# EAGLE design ahrs_v2 (EAGLE 9.6.2)
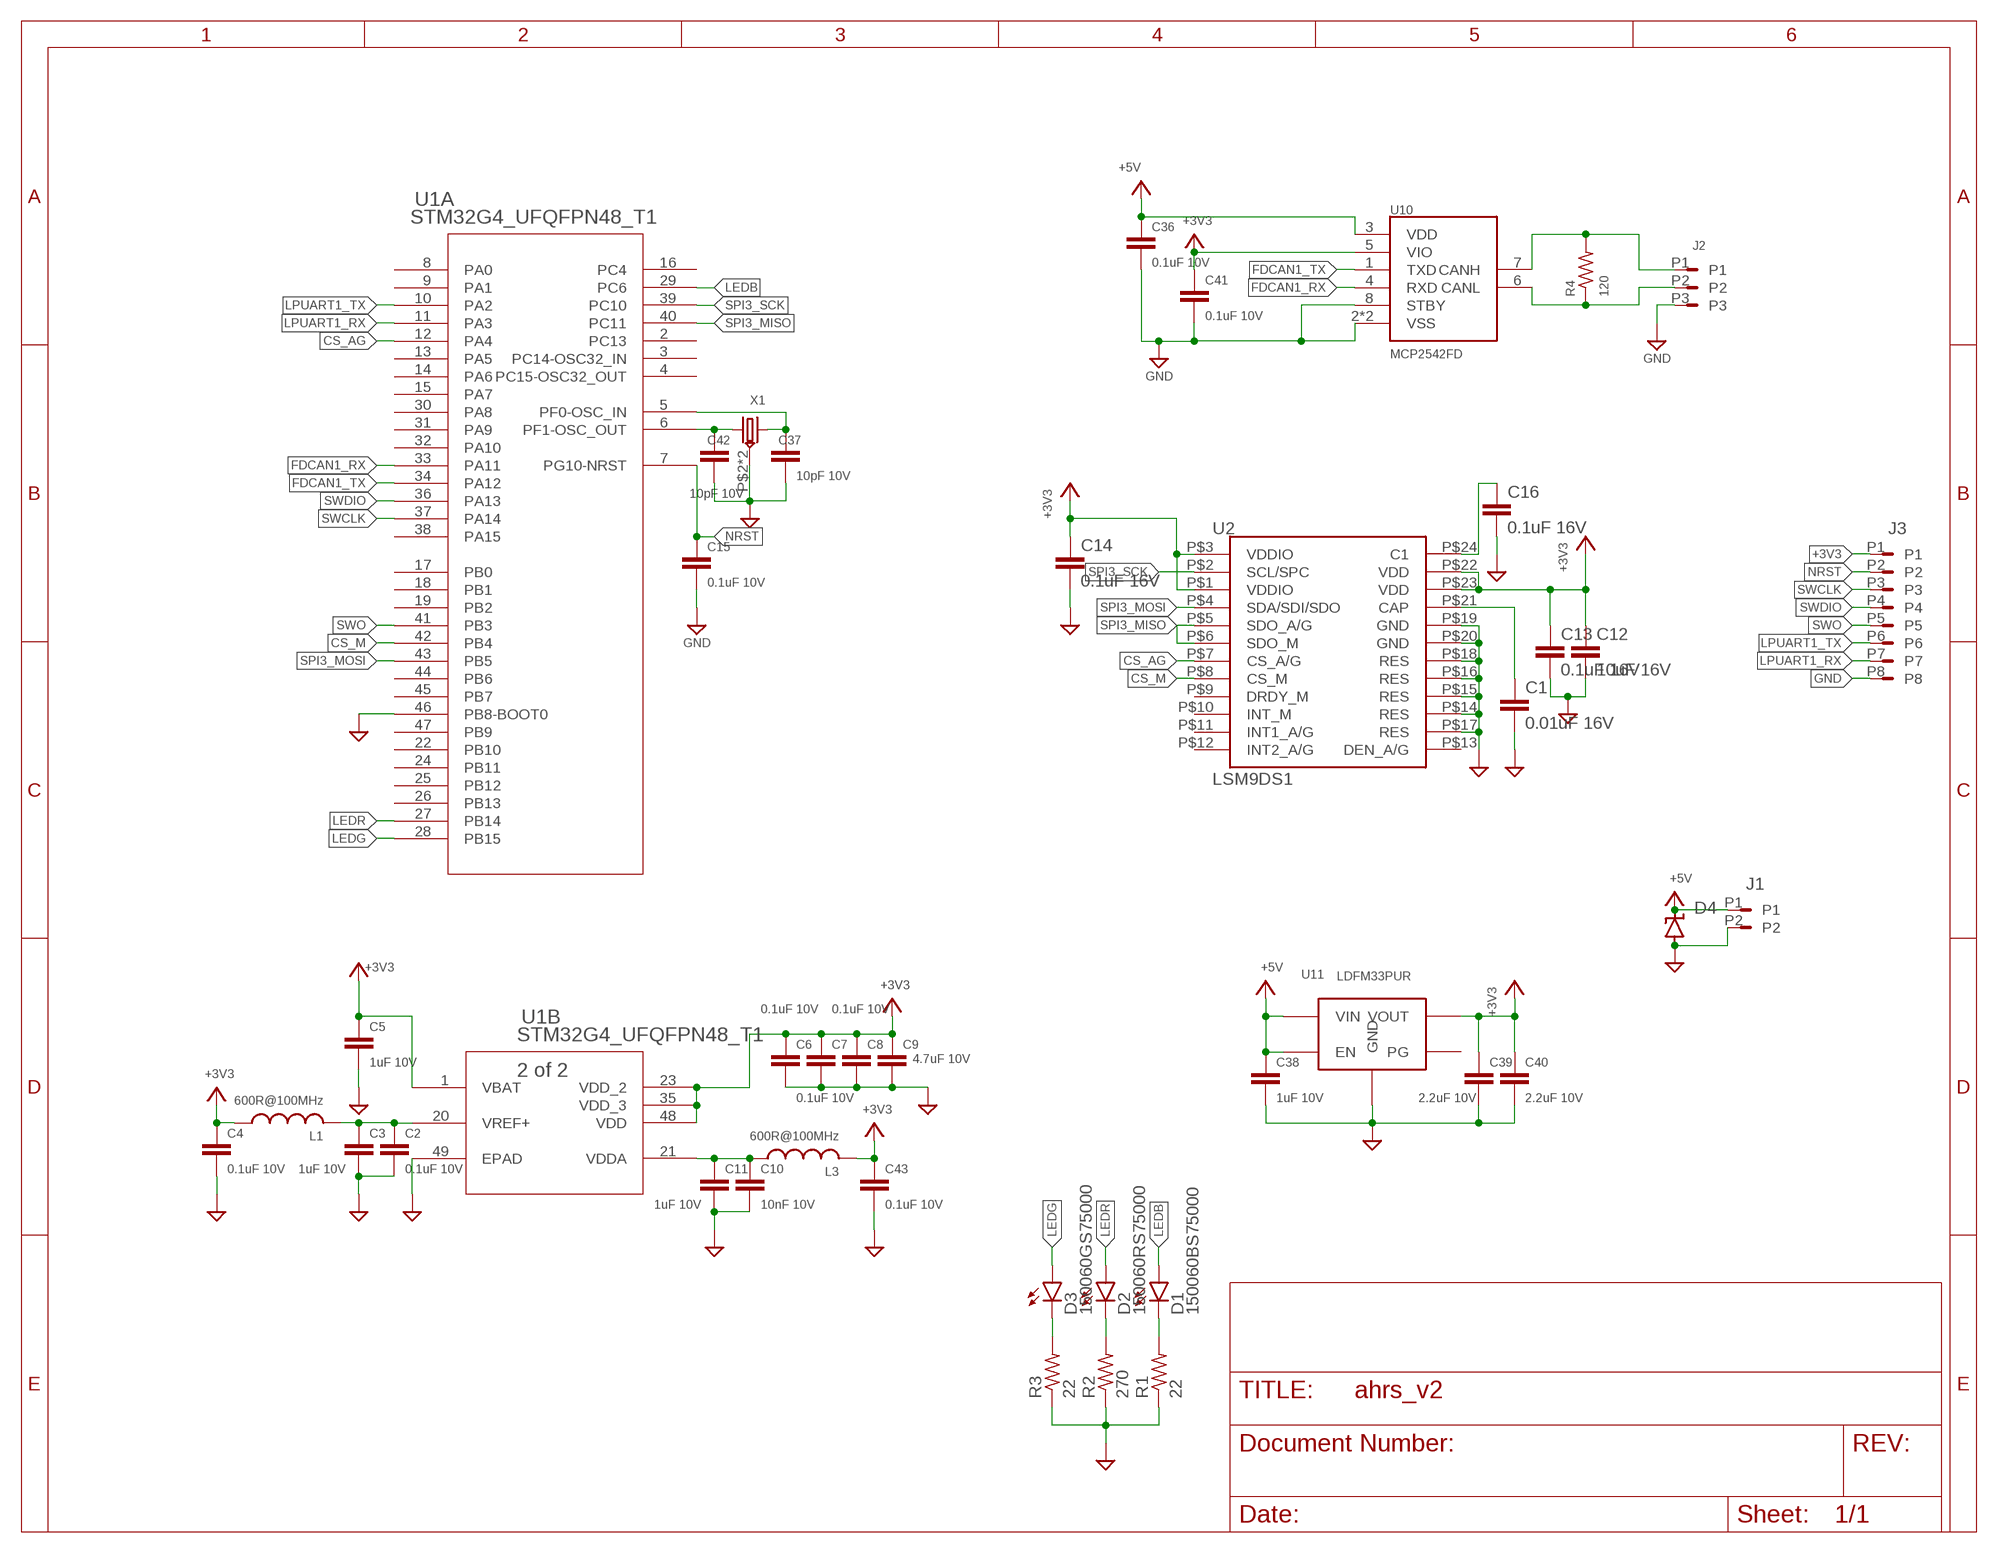
[diagram p0: schematic, sheet 1]

## Parts
C1  0.01uF 16V  C0603  [C0603]
C2  0.1uF 10V  C0603  [C0603]
C3  1uF 10V  C0603  [C0603]
C4  0.1uF 10V  C0603  [C0603]
C5  1uF 10V  C0603  [C0603]
C6  0.1uF 10V  C0603  [C0603]
C7  0.1uF 10V  C0603  [C0603]
C8  0.1uF 10V  C0603  [C0603]
C9  4.7uF 10V  C0603  [C0603]
C10  10nF 10V  C0603  [C0603]
C11  1uF 10V  C0603  [C0603]
C12  10uF 16V  C0603  [C0603]
C13  0.1uF 16V  C0603  [C0603]
C14  0.1uF 16V  C0603  [C0603]
C15  0.1uF 10V  C0603  [C0603]
C16  0.1uF 16V  C0603  [C0603]
C36  0.1uF 10V  C0603  [C0603]
C37  10pF 10V  C0603  [C0603]
C38  1uF 10V  C0603  [C0603]
C39  2.2uF 10V  C0603  [C0603]
C40  2.2uF 10V  C0603  [C0603]
C41  0.1uF 10V  C0603  [C0603]
C42  10pF 10V  C0603  [C0603]
C43  0.1uF 10V  C0603  [C0603]
D1  150060BS75000  LED_0603  [D0603]
D2  150060RS75000  LED_0603  [D0603]
D3  150060GS75000  LED_0603  [D0603]
D4  TVS_SOD123  [SOD123]
J1  LINEAR_2_5040500291  [MOLEX_5040500291]
J2  LINEAR_35040500391  [MOLEX_5040500391]
J3  LINEAR_85040500891  [MOLEX_5040500891]
L1  600R@100MHz  DC_CHOKE_FERRITE_BEAD_0603  [L0603]
L3  600R@100MHz  DC_CHOKE_FERRITE_BEAD_0603  [L0603]
R1  22  R0603  [R0603]
R2  270  R0603  [R0603]
R3  22  R0603  [R0603]
R4  120  R0603  [R0603]
U1  STM32G4_UFQFPN48_T1  [UFQFPN-48_7X7X0P55MM]
U2  LSM9DS1  [LGA24_3.5X3X1]
U10  MCP2542FD  [TDFN_2X3]
U11  LDFM33PUR  [DFN6_2X2]
X1  CRYSTAL_NX2016SA-24MHZ-EXS00A-CS11335  [NX201SA]

## Nets
+3V3 [midcurrent]: C4.1 C5.1 C6.1 C7.1 C8.1 C9.1 C12.1 C13.1 C14.1 C39.1 C40.1 C41.1 C43.1 J3.P1 L1.1 L3.2 U1.1(B:VBAT) U1.23(B:VDD_2) U1.35(B:VDD_3) U1.48(B:VDD) U2.P$1(VDDIO) U2.P$3(VDDIO) U2.P$22(VDD) U2.P$23(VDD) U10.5(VIO) U11.PIN1(VOUT)
+5V [midcurrent]: C36.1 C38.1 D4.C J1.P1 U10.3(VDD) U11.PIN5(EN) U11.PIN6(VIN)
CS_AG: U1.12(A:PA4) U2.P$7(CS_A/G)
CS_M: U1.42(A:PB4) U2.P$8(CS_M)
FDCAN1_RX: U1.33(A:PA11) U10.4(RXD)
FDCAN1_TX: U1.34(A:PA12) U10.1(TXD)
GND: C1.2 C2.2 C3.2 C4.2 C5.2 C6.2 C7.2 C8.2 C9.2 C10.2 C11.2 C12.2 C13.2 C14.2 C15.2 C16.2 C36.2 C37.2 C38.2 C39.2 C40.2 C41.2 C42.2 C43.2 D4.A J1.P2 J2.P3 J3.P8 R1.1 R2.1 R3.1 U1.46(A:PB8-BOOT0) U1.49(B:EPAD) U2.P$14(RES) U2.P$15(RES) U2.P$16(RES) U2.P$17(RES) U2.P$18(RES) U2.P$19(GND) U2.P$20(GND) U10.2(VSS) U10.8(STBY) U10.PAD(VSS) U11.PAD(GND) U11.PIN4(GND) X1.P$2(GND) X1.P$4(GND)
LEDB: D1.2(A) U1.29(A:PC6)
LEDG: D3.2(A) U1.28(A:PB15)
LEDR: D2.2(A) U1.27(A:PB14)
LPUART1_RX: J3.P7 U1.11(A:PA3)
LPUART1_TX: J3.P6 U1.10(A:PA2)
N$1: C2.1 C3.1 L1.2 U1.20(B:VREF+)
N$2: C37.1 U1.5(A:PF0-OSC_IN) X1.P$3
N$3: C42.1 U1.6(A:PF1-OSC_OUT) X1.P$1
N$4: C1.1 U2.P$21(CAP)
N$5: C16.1 U2.P$24(C1)
N$6: D3.1(C) R3.2
N$7: D2.1(C) R2.2
N$8: D1.1(C) R1.2
N$11: J2.P1 R4.2 U10.7(CANH)
N$12: J2.P2 R4.1 U10.6(CANL)
N$16 [midcurrent]: C10.1 C11.1 L3.1 U1.21(B:VDDA)
NRST: C15.1 J3.P2 U1.7(A:PG10-NRST)
SPI3_MISO: U1.40(A:PC11) U2.P$5(SDO_A/G) U2.P$6(SDO_M)
SPI3_MOSI: U1.43(A:PB5) U2.P$4(SDA/SDI/SDO)
SPI3_SCK: U1.39(A:PC10) U2.P$2(SCL/SPC)
SWCLK: J3.P3 U1.37(A:PA14)
SWDIO: J3.P4 U1.36(A:PA13)
SWO: J3.P5 U1.41(A:PB3)
Unconnected: J1.MNT@1(GND) J1.MNT@2(GND) J2.MNT@1(GND) J2.MNT@2(GND) J3.MNT@1(GND) J3.MNT@2(GND) U1.2(A:PC13) U1.3(A:PC14-OSC32_IN) U1.4(A:PC15-OSC32_OUT) U1.8(A:PA0) U1.9(A:PA1) U1.13(A:PA5) U1.14(A:PA6) U1.15(A:PA7) U1.16(A:PC4) U1.17(A:PB0) U1.18(A:PB1) U1.19(A:PB2) U1.22(A:PB10) U1.24(A:PB11) U1.25(A:PB12) U1.26(A:PB13) U1.30(A:PA8) U1.31(A:PA9) U1.32(A:PA10) U1.38(A:PA15) U1.44(A:PB6) U1.45(A:PB7) U1.47(A:PB9) U2.P$9(DRDY_M) U2.P$10(INT_M) U2.P$11(INT1_A/G) U2.P$12(INT2_A/G) U2.P$13(DEN_A/G) U11.PIN3(PG)

## Library data of the parts
C1-C16 C36-C43 = _T_rcl:C
D1-D3 = _T_rcl:LED
D4 = _T_rcl:TVS
J1 = _T_conn:LINEAR_2
J2 = _T_conn:LINEAR_3
J3 = _T_conn:LINEAR_8
L1 L3 = _T_rcl:DC_CHOKE
R1-R4 = _T_rcl:R
U1 = _T_ic:STM32G4_UFQFPN48_T1; BUILT_BY: EMA_Jessica; COPYRIGHT: Copyright (C) 2016 Accelerated Designs. All rights reserved; MANUFACTURER_PART_NUMBER: stm32g4_ufqfpn48_t1; VENDOR: STMicroelectronics
U2 = _T_ic:LSM9DS1: datasheet
U10 = _T_ic:MCP2542FD
U11 = _T_ic:LDFM
X1 = _T_ic:CRYSTAL

## Net classes
0 default: width 0.2 mm, drill 0.3 mm, clearance 0.152 mm
3 midcurrent: width 0.25 mm, drill 0.3 mm, clearance 0.178 mm

## Board
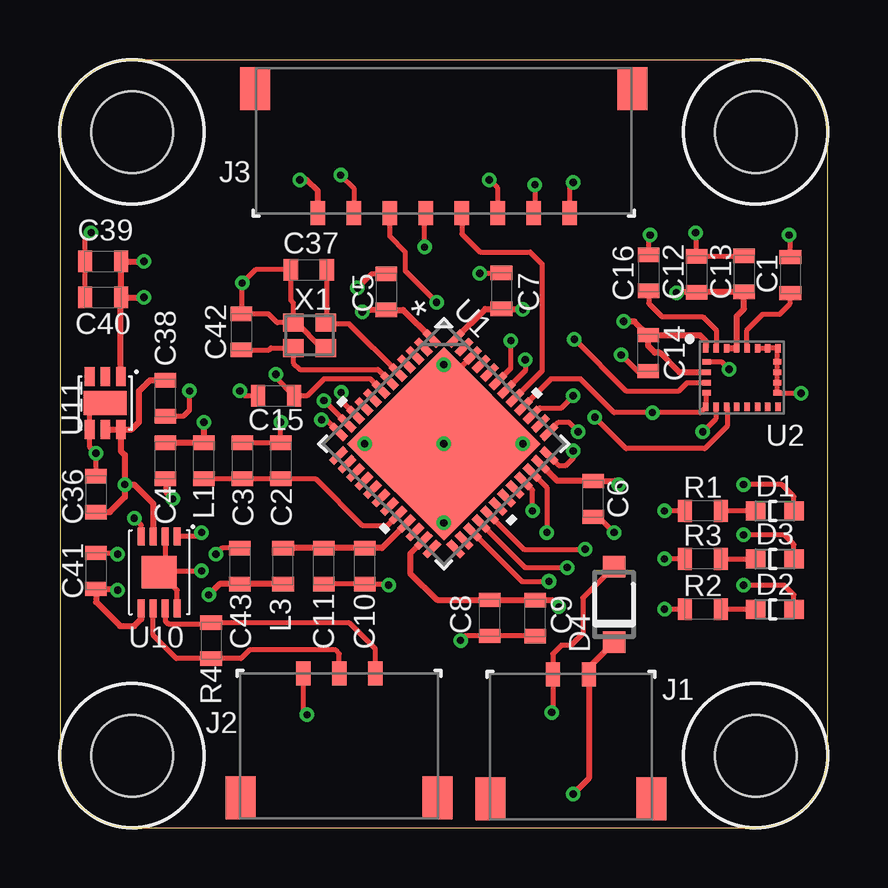
[diagram p1: board, top side]
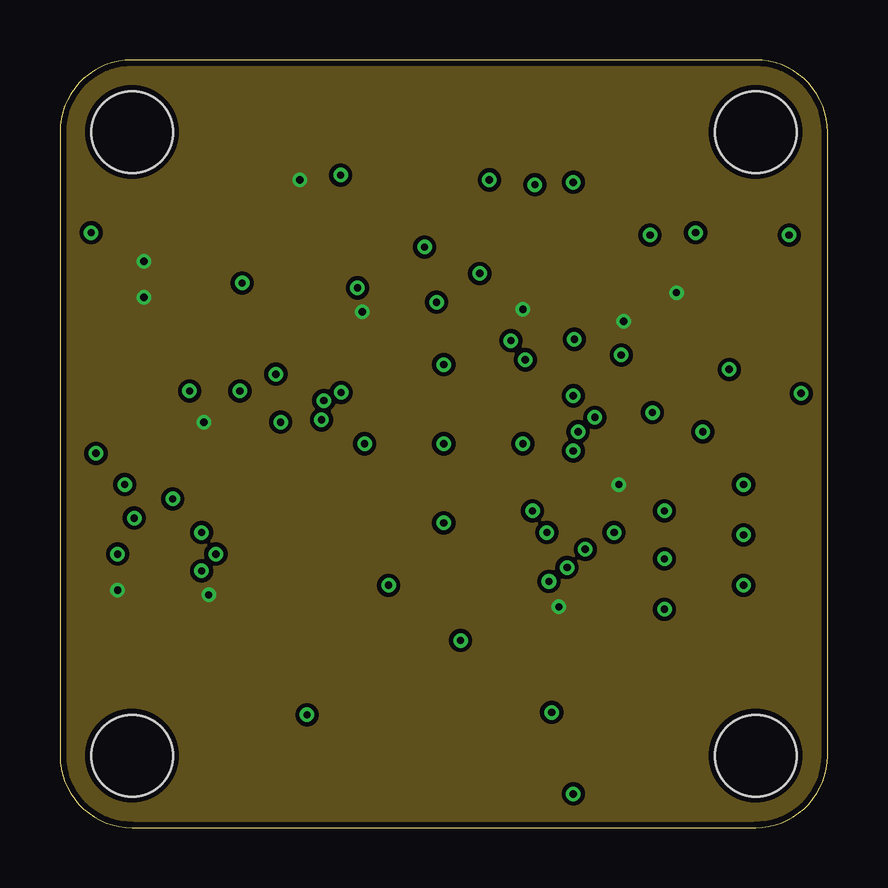
[diagram p2: board, inner layer Route2]
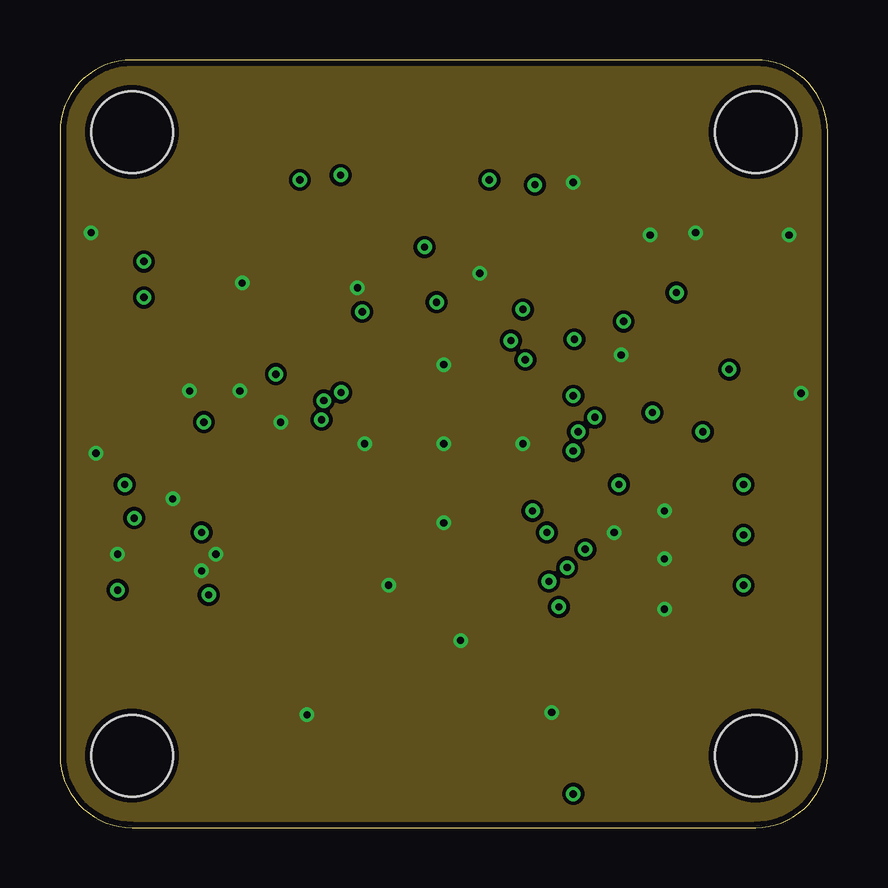
[diagram p3: board, inner layer Route15]
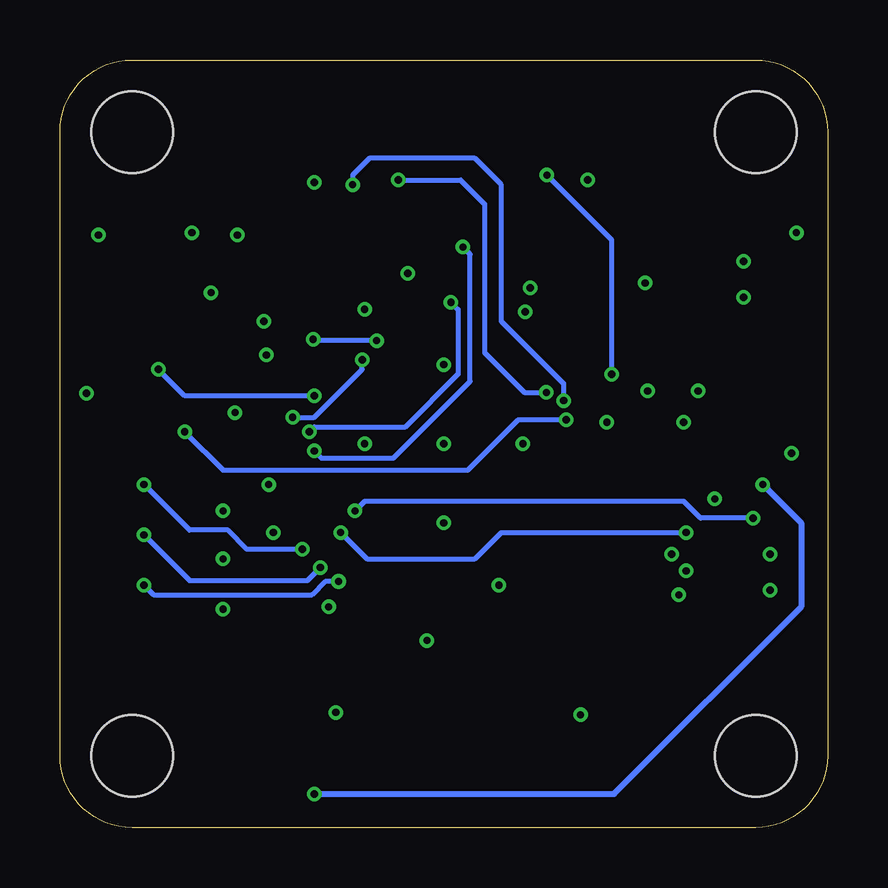
[diagram p4: board, bottom side, seen from below]

Size 32 x 32 mm. Coordinates in mm from the lower left corner, seen from the top.
Outline: 0,3 arc90 3,0 29,0 arc90 32,3 32,29 arc90 29,32 3,32 arc90 0,29 0,3
Copper layers (1*2*15*16): Top 0.035mm / dielectric 0.11mm / Route2 0.035mm / dielectric 1.31mm / Route15 0.035mm / dielectric 0.11mm / Bottom 0.035mm
Design rules "pcbway_4_layer_TIM": minimum track width 6mil, minimum drill 0.29mm, track to track 6mil, track to pad 6mil, pad to pad 6mil, via to via 6mil, smd to smd 0mil, copper to edge 0.25mm, drill to drill 10mil, minimum pad ring 6mil, minimum via ring 6mil, stop-mask expansion 2mil, vias tented up to drill 0mil, thermal gap 10mil
Holes 3.4 mm at 3,3 29,29 3,29 29,3

### Footprints (pad centres in the part's own frame; a part is rotated, then mirrored left to right if it is on the bottom)
C0603 = smd 0.6 x 0.9: 1 0.75,0; 2 -0.75,0
D0603 = smd 0.8 x 0.8: 1 -0.8,0; 2 0.8,0
SOD123 = smd 0.9 x 0.95: A 1.575,0; C -1.575,0
MOLEX_5040500291 = smd 1.25 x 1.8: MNT@1 3.355,5.2; MNT@2 -3.355,5.2 | smd 0.6 x 1: P1 -0.75,0.01; P2 0.75,0.01
MOLEX_5040500391 = smd 1.25 x 1.8: MNT@1 4.105,5.2; MNT@2 -4.105,5.2 | smd 0.6 x 1: P1 -1.5,0.01; P2 0,0.01; P3 1.5,0.01
MOLEX_5040500891 = smd 1.25 x 1.8: MNT@1 7.855,5.2; MNT@2 -7.855,5.2 | smd 0.6 x 1: P1 -5.25,0.01; P2 -3.75,0.01; P3 -2.25,0.01; P4 -0.75,0.01; P5 0.75,0.01; P6 2.25,0.01; P7 3.75,0.01; P8 5.25,0.01
L0603 = smd 0.6 x 0.9: 1 0.75,0; 2 -0.75,0
R0603 = smd 0.6 x 0.9: 1 0.75,0; 2 -0.75,0
UFQFPN-48_7X7X0P55MM = smd 0.813 x 0.305: 1 -3.454,2.75; 2 -3.454,2.25; 3 -3.454,1.75; 4 -3.454,1.25; 5 -3.454,0.75; 6 -3.454,0.25; 7 -3.454,-0.25; 8 -3.454,-0.75; 9 -3.454,-1.25; 10 -3.454,-1.75; 11 -3.454,-2.25; 12 -3.454,-2.75; 25 3.454,-2.75; 26 3.454,-2.25; 27 3.454,-1.75; 28 3.454,-1.25; 29 3.454,-0.75; 30 3.454,-0.25; 31 3.454,0.25; 32 3.454,0.75; 33 3.454,1.25; 34 3.454,1.75; 35 3.454,2.25; 36 3.454,2.75 | smd 0.305 x 0.813: 13 -2.75,-3.454; 14 -2.25,-3.454; 15 -1.75,-3.454; 16 -1.25,-3.454; 17 -0.75,-3.454; 18 -0.25,-3.454; 19 0.25,-3.454; 20 0.75,-3.454; 21 1.25,-3.454; 22 1.75,-3.454; 23 2.25,-3.454; 24 2.75,-3.454; 37 2.75,3.454; 38 2.25,3.454; 39 1.75,3.454; 40 1.25,3.454; 41 0.75,3.454; 42 0.25,3.454; 43 -0.25,3.454; 44 -0.75,3.454; 45 -1.25,3.454; 46 -1.75,3.454; 47 -2.25,3.454; 48 -2.75,3.454 | smd 5.69 x 5.69: 49 0,0
LGA24_3.5X3X1 = smd 0.23 x 0.35: P$1 -1.505,1.225; P$6 -1.505,-1.225; P$7 -1.075,-1.225; P$8 -0.645,-1.225; P$9 -0.215,-1.225; P$10 0.215,-1.225; P$11 0.645,-1.225; P$12 1.075,-1.225; P$13 1.505,-1.225; P$18 1.505,1.225; P$19 1.075,1.225; P$20 0.645,1.225; P$21 0.215,1.225; P$22 -0.215,1.225; P$23 -0.645,1.225; P$24 -1.075,1.225 | smd 0.35 x 0.23: P$2 -1.475,0.645; P$3 -1.475,0.215; P$4 -1.475,-0.215; P$5 -1.475,-0.645; P$14 1.475,-0.645; P$15 1.475,-0.215; P$16 1.475,0.215; P$17 1.475,0.645
TDFN_2X3 = smd 0.3 x 0.75: 1 -0.75,-1.5; 2 -0.25,-1.5; 3 0.25,-1.5; 4 0.75,-1.5; 5 0.75,1.5; 6 0.25,1.5; 7 -0.25,1.5; 8 -0.75,1.5 | smd 1.46 x 1.36: PAD 0,0
DFN6_2X2 = smd 1.8 x 1: PAD 0,0 | smd 0.4 x 0.8: PIN1 0.65,1.1; PIN2 0,1.1; PIN3 -0.65,1.1; PIN4 -0.65,-1.1; PIN5 0,-1.1; PIN6 0.65,-1.1
NX201SA = smd 0.85 x 0.75: P$1 -0.675,-0.525; P$2 0.675,-0.525; P$3 0.675,0.525; P$4 -0.675,0.525

### Placement (x,y rotation side)
C1  30.45,23.03 270 top
C2  9.2,15.3 270 top
C3  7.6,15.3 270 top
C4  4.4,15.3 90 top
C5  13.6,22.33 270 top
C6  22.23,13.7 90 top
C7  18.41,22.37 270 top
C8  17.91,8.74 90 top
C9  19.81,8.73 90 top
C10  12.7,10.9 90 top
C11  11,10.9 90 top
C12  26.54,23.07 270 top
C13  28.52,23.08 270 top
C14  24.52,19.78 90 top
C15  9.01,18 0 top
C16  24.55,23.12 270 top
C36  1.5,13.9 270 top
C37  10.37,23.26 0 top
C38  4.4,17.9 90 top
C39  1.8,23.6 0 top
C40  1.8,22.1 0 top
C41  1.5,10.7 270 top
C42  7.56,20.66 270 top
C43  7.5,10.9 270 top
D1  29.8,13.2 0 top
D2  29.8,9.1 0 top
D3  29.8,11.2 0 top
D4  23.1,9.3 90 top
J1  21.3,6.4 180 top
J2  11.64,6.44 180 top
J3  16,25.6 0 top
L1  6,15.3 90 top
L3  9.3,10.9 90 top
R1  26.8,13.2 180 top
R2  26.8,9.1 180 top
R3  26.8,11.2 180 top
R4  6.3,7.8 270 top
U1  16,16 315 top
U2  28.43,18.76 0 top
U10  4.14,10.64 180 top
U11  1.89,17.7 0 top
X1  10.4,20.52 0 top

### Tracks (layer width: path | path; a pad name or v marks a point on that pad's centre or on a via)
+3V3  (via drill 0.3)
  Top 0.25: U10.5 3.39,8.69 3.1,8.4 2.5,8.4 1.5,9.4 C41.1 2.35,9.95 v2.4,9.9 | U11.PIN1 C40.1 | C40.1 C39.1 v3.5,23.6 | C40.1 v3.5,22.1 | C4.1 L1.1 v6,16.9 | L3.2 C43.1 6.65,10.15 v6.2,9.7 | U1.23 14.6,11.42 14.6,10.6 15.71,9.49 C8.1 C9.1 20.52,9.48 v20.8,9.2 | U1.35 20.73,14.45 C6.1 23.15,14.45 v23.3,14.3 | J3.P1 10.75,26.55 10.3,27 v10,27 | U1.1 14.31,21.58 C5.1 12.68,21.58 v12.6,21.5 | U1.48 17.73,21.62 C7.1 19.28,21.62 v19.3,21.6 | U2.P$3 25.82,18.98 25,19.8 24.8,19.8 24.52,20.08 C14.1 | C14.1 26.68,20.53 26.93,20.29 U2.P$1 | U2.P$23 U2.P$22 28.21,21.32 28.52,21.62 C13.1 28.51,22.32 C12.1 25.72,22.32 v25.7,22.3 | C14.1 23.95,21.1 v23.5,21.1
  pour Route2: -0.4,33.9 32.7,33.9 32.7,-1.2 -0.4,-1.2
+5V  (via drill 0.3)
  Top 0.25: v21.4,1.4 22.05,2.05 J1.P1 22.05,6.67 D4.C | v2.7,14.3 3.1,14.3 3.89,13.51 U10.3 | C36.1 2.08,13.15 2.7,13.77 v2.7,14.3 | U11.PIN5 U11.PIN6 | U11.PIN6 2.54,15.7 2.7,15.54 v2.7,14.3 | U11.PIN6 3,16.6 3.3,16.9 3.3,18.2 3.75,18.65 C38.1
  Bottom 0.25: v21.4,1.4 8.9,1.4 1.1,9.2 1.1,12.7 v2.7,14.3
CS_AG  (via drill 0.3)
  Top 0.2: U1.12 11.11,17 v10.9,17 | v26.8,16.5 27.36,17.05 U2.P$7
  Bottom 0.2: v10.9,17 12.9,17 15,14.9 25.2,14.9 v26.8,16.5
CS_M  (via drill 0.3)
  Top 0.2: U2.P$8 27.82,17.5 27.82,16.74 26.89,15.8 23.6,15.8 v22.3,17.1 | v19.4,19.5 19.4,19.05 U1.42
  Bottom 0.2: v22.3,17.1 21.4,17.1 19.4,19.1 v19.4,19.5
FDCAN1_RX  (via drill 0.3)
  Top 0.2: U10.4 3.39,12.61 v3.1,12.9 | v19.7,13.2 19.7,14.07 U1.33
  Bottom 0.2: v3.1,12.9 5.3,12.9 6,13.6 19.3,13.6 v19.7,13.2
FDCAN1_TX  (via drill 0.3)
  Top 0.2: U1.34 20.3,14.18 v20.3,12.3 | v5.9,12.3 5.74,12.14 U10.1
  Bottom 0.2: v20.3,12.3 19.2,11.2 14.7,11.2 13.6,12.3 v5.9,12.3
GND  (via drill 0.3)
  Top 0.2: v20.5,4.8 20.55,4.85 20.55,6.3 J1.P2 20.55,7.25 20.9,7.6 21.3,7.6 21.8,8.1 21.8,9.57 D4.A | J2.P3 10.14,4.86 v10.3,4.7 | U11.PAD 1.4,17.7 1.2,17.5 1.24,17.46 U11.PIN4 1.24,15.86 v1.5,15.6 C36.2 | U10.2 4.39,10.89 U10.PAD | U10.PAD 4.2,10.7 v5.9,10.7 | U10.8 4.89,9.89 U10.PAD | C41.2 2.35,11.45 v2.4,11.4 | C40.2 C39.2 1.05,24.55 v1.3,24.8 | X1.P$2 10.91,19.99 9.86,21.04 X1.P$4 | X1.P$4 9.06,21.04 8.69,21.41 C42.2 7.6,21.45 v7.6,22.7 8.16,23.26 C37.2 9.62,21.98 9.72,21.88 X1.P$4 | C15.2 7.7,18 v7.5,18.2 | C38.2 5.15,17.15 5.4,17.4 v5.4,18.2 | C4.2 4.4,14 v4.7,13.7 | C11.2 C10.2 13.65,10.15 v13.7,10.1 | C43.2 6.75,11.65 v6.5,11.4 | C3.2 C2.2 v9.2,16.9 | C9.2 17.92,7.98 C8.2 16.89,7.99 v16.7,7.8 | C6.2 22.45,12.95 v23.1,12.3 | C5.2 12.98,23.08 v12.4,22.5 | C7.2 18.39,23.1 v17.5,23.1 | U1.46 16,18.48 U1.49 | U2.P$20 U2.P$19 U2.P$18 29.91,19.96 U2.P$17 U2.P$16 U2.P$15 U2.P$14 30.88,18.12 v30.9,18.1 | C14.2 24.07,19.03 v23.4,19.7 | C13.2 28.51,23.82 C12.2 26.54,24.76 v26.5,24.8 | C16.2 24.55,24.65 v24.6,24.7 | R1.1 v25.2,13.2 | R3.1 v25.2,11.2 | R2.1 v25.2,9.1 | J3.P8 21.25,26.75 v21.4,26.9 | C1.2 30.45,24.65 v30.4,24.7
  other vias: 16,16 12.7,16 16,19.3 19.3,16 16,12.7
  pour Route15: -0.4,33.9 32.7,33.9 32.7,-1.2 -0.4,-1.2
LEDB  (via drill 0.3)
  Top 0.2: v21.9,11.6 19.34,11.6 U1.29 | D1.2 30.6,13.8 30.1,14.3 v28.5,14.3
  Bottom 0.2: v21.9,11.6 24.2,11.6 25,12.4 26.6,12.4 v28.5,14.3
LEDG  (via drill 0.3)
  Top 0.2: v21.14,10.84 19.39,10.84 U1.28 | D3.2 30.6,11.8 30.2,12.2 v28.5,12.2
  Bottom 0.2: v28.5,12.2 26.6,10.3 21.69,10.3 v21.14,10.84
LEDR  (via drill 0.3)
  Top 0.2: v20.39,10.26 19.27,10.26 U1.27 | D2.2 30.6,9.7 30.2,10.1 v28.5,10.1
  Bottom 0.2: v20.39,10.26 20.94,10.26 21.5,9.7 28.1,9.7 v28.5,10.1
LPUART1_RX  (via drill 0.3)
  Top 0.2: U1.11 11.02,17.8 v11,17.8 | v19.8,26.8 19.8,25.66 J3.P7
  Bottom 0.2: v11,17.8 11,18.5 13.6,21.1 13.6,26.8 14.7,27.9 19.1,27.9 19.8,27.2 v19.8,26.8
LPUART1_TX  (via drill 0.3)
  Top 0.2: J3.P6 18.25,26.65 v17.9,27 | v11.72,18.14 11.72,17.8 U1.10
  Bottom 0.2: v17.9,27 15.3,27 14.3,26 14.3,19.8 12.64,18.14 v11.72,18.14
N$1
  Top 0.2: L1.2 C3.1 C2.1 10.65,14.55 12.6,12.6 13.66,12.6 U1.20
N$2
  Top 0.2: U1.5 12.06,21 11.12,21 | 11.12,21 X1.P$3 | C37.1 11.12,21
N$3
  Top 0.2: U1.6 13.25,19.1 10,19.1 9.72,19.38 X1.P$1 8.79,19.99 8.71,19.91 C42.1
N$4
  Top 0.2: U2.P$21 28.64,20.75 29.3,21.4 30,21.4 30.45,21.85 C1.1
N$5
  Top 0.2: C16.1 24.55,21.85 25.1,21.3 26.8,21.3 27.36,20.75 U2.P$24
N$6
  Top 0.2: R3.2 D3.1
N$7
  Top 0.2: D2.1 R2.2
N$8
  Top 0.2: D1.1 R1.2
N$11
  Top 0.2: U10.7 4.39,8.61 4.5,8.5 6.25,8.5 R4.2 12.05,8.55 13.14,7.46 J2.P1
N$12
  Top 0.2: J2.P2 11.64,7.26 11.5,7.4 7.9,7.4 7.55,7.05 R4.1 4.85,7.05 3.89,8.01 U10.6
N$16
  Top 0.25: U1.21 13.42,11.65 C10.1 C11.1 L3.1
NRST  (via drill 0.3)
  Top 0.2: U1.7 12.95,18.7 11,18.7 10.3,18 C15.1 9,18.76 v9,18.9 | v11.7,27.2 12.25,26.65 J3.P2
  Bottom 0.2: v9,18.9 9,24.5 v11.7,27.2
SPI3_MISO  (via drill 0.3)
  Top 0.2: U2.P$5 26.93,18.09 U2.P$6 26.69,17.3 v24.7,17.3 23.1,17.3 21.7,18.7 20.47,18.7 U1.40
SPI3_MOSI  (via drill 0.3)
  Top 0.2: U2.P$4 26.15,18.55 25.8,18.2 23.6,18.2 v21.45,20.36 | U1.43 18.8,19.15 v18.8,20.3
  Bottom 0.2: v18.8,20.3 21.39,20.3 v21.45,20.36
SPI3_SCK  (via drill 0.3)
  Top 0.2: U1.39 19.71,17.2 20.01,17.5 20.9,17.5 v21.4,18 | v27.9,19.1 27.59,19.41 U2.P$2
  Bottom 0.2: v21.4,18 26.8,18 v27.9,19.1
SWCLK  (via drill 0.3)
  Top 0.2: U1.37 20.79,16.9 21.2,16.9 v21.6,16.5 | v15.7,21.9 14.4,23.2 14.4,24 13.75,24.65 J3.P3
  Bottom 0.2: v21.6,16.5 21.4,16.7 17.6,16.7 15.4,18.9 15.4,21.6 v15.7,21.9
SWDIO  (via drill 0.3)
  Top 0.2: U1.36 20.79,15.1 21.1,15.1 21.4,15.4 v21.4,15.7 | v15.2,24.2 15.2,25.56 J3.P4
  Bottom 0.2: v21.4,15.7 21.1,15.4 18.1,15.4 14.9,18.6 14.9,23.9 v15.2,24.2
SWO
  Top 0.2: J3.P5 16.75,24.75 17.5,24 19.6,24 20.1,23.5 20.1,19.04 U1.41